# Altium project LED.PrjPcb
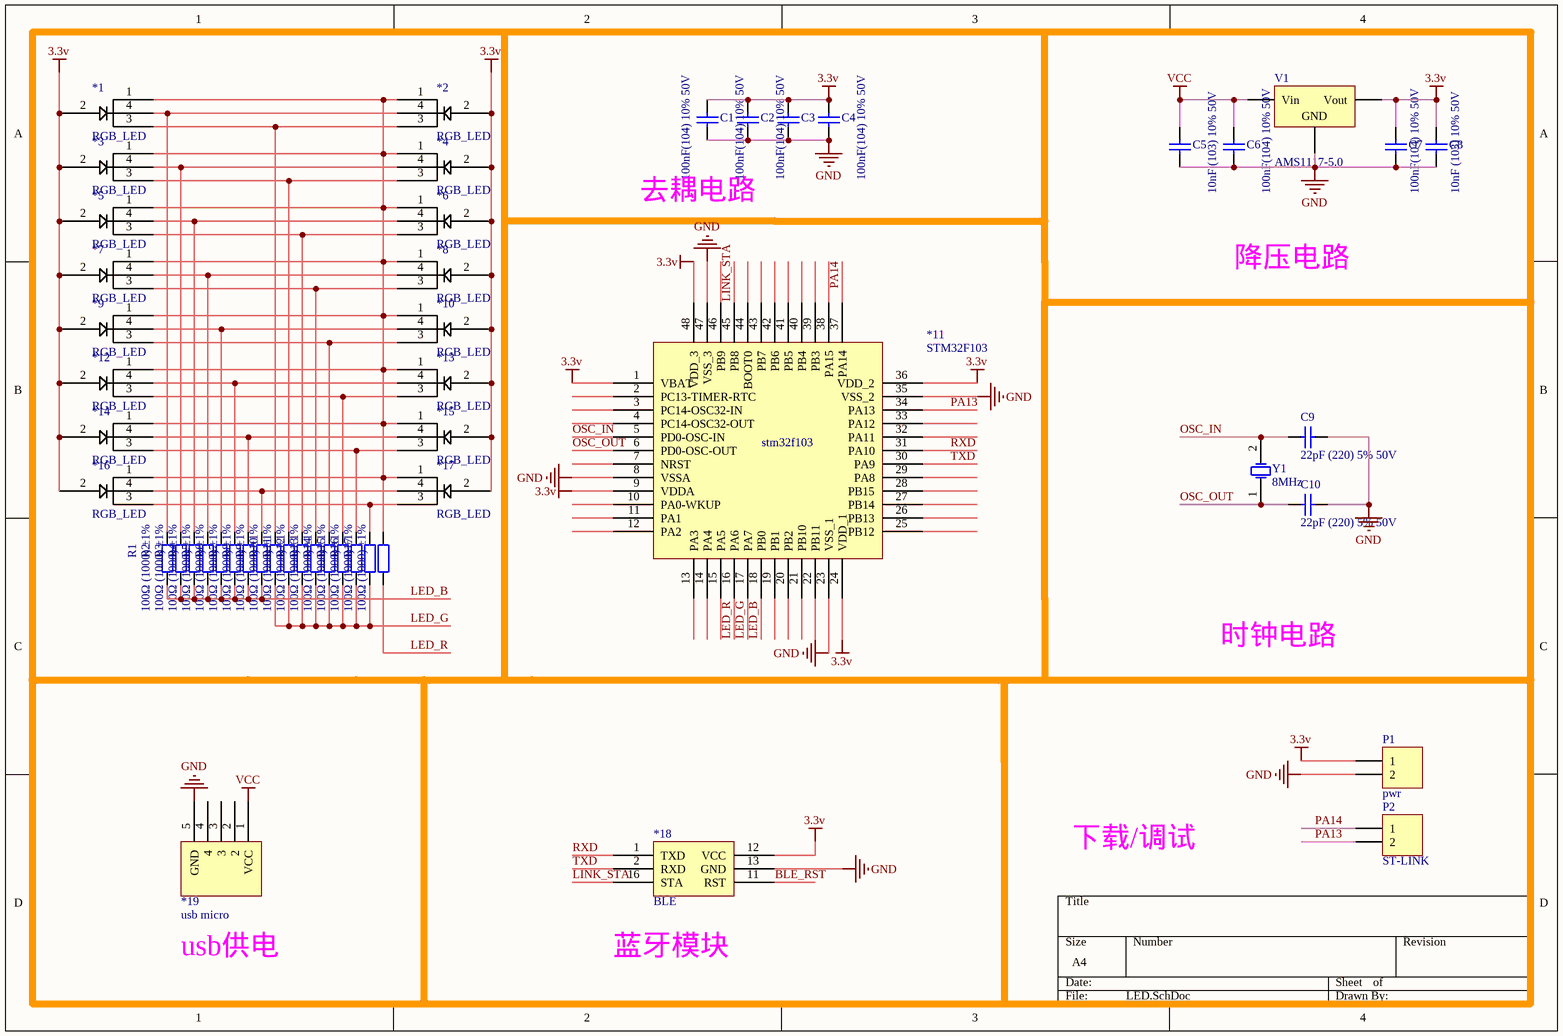
[diagram p0: LED.SchDoc]
1 sheet, 50 parts. Net scope: global (net labels, ports and power ports of the same name join across sheets).
Board file: LED.PcbDoc

## Sheet LED.SchDoc
size A4

### Parts
*1  RGB_LED  [LED_RGB]
*2  RGB_LED  [LED_RGB]
*3  RGB_LED  [LED_RGB]
*4  RGB_LED  [LED_RGB]
*5  RGB_LED  [LED_RGB]
*6  RGB_LED  [LED_RGB]
*7  RGB_LED  [LED_RGB]
*8  RGB_LED  [LED_RGB]
*9  RGB_LED  [LED_RGB]
*10  RGB_LED  [LED_RGB]
*11  STM32F103  [STM32 C8T6]
*12  RGB_LED  [LED_RGB]
*13  RGB_LED  [LED_RGB]
*14  RGB_LED  [LED_RGB]
*15  RGB_LED  [LED_RGB]
*16  RGB_LED  [LED_RGB]
*17  RGB_LED  [LED_RGB]
*18  BLE  [BLE]
*19  usb micro  [MICRO_USB]
C1  100nF(104) 10% 50V  [0805_C]
C2  100nF(104) 10% 50V  [0805_C]
C3  100nF(104) 10% 50V  [0805_C]
C4  100nF(104) 10% 50V  [0805_C]
C5  10nF (103) 10% 50V  [0805_C]
C6  100nF(104) 10% 50V  [0805_C]
C7  100nF(104) 10% 50V  [0805_C]
C8  10nF (103) 10% 50V  [0805_C]
C9  22pF (220) 5% 50V  [0805_C]
C10  22pF (220) 5% 50V  [0805_C]
P1  pwr  [HDR1X2]
P2  ST-LINK  [HDR1X2]
R1  100Ω (1000) ±1%  [0805_R]
R2  100Ω (1000) ±1%  [0805_R]
R3  100Ω (1000) ±1%  [0805_R]
R4  100Ω (1000) ±1%  [0805_R]
R5  100Ω (1000) ±1%  [0805_R]
R6  100Ω (1000) ±1%  [0805_R]
R7  100Ω (1000) ±1%  [0805_R]
R8  100Ω (1000) ±1%  [0805_R]
R9  100Ω (1000) ±1%  [0805_R]
R10  100Ω (1000) ±1%  [0805_R]
R11  100Ω (1000) ±1%  [0805_R]
R12  100Ω (1000) ±1%  [0805_R]
R13  100Ω (1000) ±1%  [0805_R]
R14  100Ω (1000) ±1%  [0805_R]
R15  100Ω (1000) ±1%  [0805_R]
R16  100Ω (1000) ±1%  [0805_R]
R17  100Ω (1000) ±1%  [0805_R]
V1  AMS1117-5.0  [SOT-223]
Y1  8MHz  [XTAL_US]

### Nets
3.3v: *1.2 *2.2 *3.2 *4.2 *5.2 *6.2 *7.2 *8.2 *9.2 *10.2 *11.1(VBAT) *11.9(VDDA) *11.24(VDD_1) *11.36(VDD_2) *11.48(VDD_3) *12.2 *13.2 *14.2 *15.2 *16.2 *17.2 *18.12(VCC) C1.2 C2.2 C3.2 C4.2 C7.2 C8.2 P1.1 V1.2(Vout)
GND: *11.8(VSSA) *11.23(VSS_1) *11.35(VSS_2) *11.47(VSS_3) *18.13(GND) *19.5(GND) C1.1 C2.1 C3.1 C4.1 C5.1 C6.1 C7.1 C8.1 C9.2 C10.2 P1.2 V1.1(GND)
VCC: *19.1(VCC) C5.2 C6.2 V1.3(Vin)
BLE_RST: *18.11(RST)
LED_B: *11.18(PB0) R1.2 R2.2 R3.2 R4.2 R5.2 R6.2 R7.2 R8.2
LED_G: *11.17(PA7) R9.2 R10.2 R11.2 R12.2 R13.2 R14.2 R15.2 R16.2
LED_R: *11.16(PA6) R17.2
LINK_STA: *11.45(PB8) *18.16(STA)
OSC_IN: *11.5(PD0-OSC-IN) C9.1 Y1.2(OSC2)
OSC_OUT: *11.6(PD0-OSC-OUT) C10.1 Y1.1(OSC1)
PA13: *11.34(PA13) P2.2
PA14: *11.37(PA14) P2.1
RXD: *11.31(PA10) *18.1(TXD)
TXD: *11.30(PA9) *18.2(RXD)
Net*1_1: *1.1 *2.1 *3.1 *4.1 *5.1 *6.1 *7.1 *8.1 *9.1 *10.1 *12.1 *13.1 *14.1 *15.1 *16.1 *17.1 R17.1
Net*1_3: *1.3 *2.3 R9.1
Net*1_4: *1.4 *2.4 R1.1
Net*3_3: *3.3 *4.3 R10.1
Net*3_4: *3.4 *4.4 R2.1
Net*5_3: *5.3 *6.3 R11.1
Net*5_4: *5.4 *6.4 R3.1
Net*7_3: *7.3 *8.3 R12.1
Net*7_4: *7.4 *8.4 R4.1
Net*9_3: *9.3 *10.3 R13.1
Net*9_4: *9.4 *10.4 R5.1
Net*12_3: *12.3 *13.3 R14.1
Net*12_4: *12.4 *13.4 R6.1
Net*14_3: *14.3 *15.3 R15.1
Net*14_4: *14.4 *15.4 R7.1
Net*16_3: *16.3 *17.3 R16.1
Net*16_4: *16.4 *17.4 R8.1

Not connected (* = marked no-connect by the designer): *11 2(PC13-TIMER-RTC) 3(PC14-OSC32-IN) 4(PC14-OSC32-OUT) 7(NRST) 10(PA0-WKUP) 11(PA1) 12(PA2) 13(PA3) 14(PA4) 15(PA5) 19(PB1) 20(PB2) 21(PB10) 22(PB11) 25(PB12) 26(PB13) 27(PB14) 28(PB15) 29(PA8) 32(PA11) 33(PA12) 38(PA15) 39(PB3) 40(PB4) 41(PB5) 42(PB6) 43(PB7) 44(BOOT0) 46(PB9); *19 2 3 4

### Notes on the sheet
- 去耦电路
- 降压电路
- 时钟电路
- 下载/调试
- usb供电
- (near *18) 蓝牙模块
- (in symbol STM32F103) stm32f103

### Library data of the parts
C1-C4 C6 C7 = 0805 100nF(104) 10% 50V: 贴片电容; ComponentLink1Description: 供应商链接; ComponentLink1URL: http://www.szlcsc.com/product/details_50686.html; Package: 0805; Supplier: LC; SuppliersPartNumber: C49678
C5 C8 = 0805 10nF (103) 10% 50V: 贴片电容; ComponentLink1Description: 供应商链接; ComponentLink1URL: http://www.szlcsc.com/product/details_2062.html; Package: 0805; Supplier: LC; SuppliersPartNumber: C1710
C9 C10 = 0805 22pF (220) 5% 50V: 贴片电容; ComponentLink1Description: 供应商链接; ComponentLink1URL: http://www.szlcsc.com/product/details_2156.html; Package: 0805; Supplier: LC; SuppliersPartNumber: C1804
P1 P2 = Header 2: Header, 2-Pin; LatestRevisionDate: 17-Jul-2002; LatestRevisionNote: Re-released for DXP Platform.; Publisher: Altium Limited
R1-R17 = 0805 100Ω (1000) 1%: 贴片电阻; ComponentLink1Description: 供应商链接; ComponentLink1URL: http://www.szlcsc.com/product/details_18096.html; Package: 0805; Supplier: LC; SuppliersPartNumber: C17408
V1 = SOT-223 AMS1117-5.0: 低压差线性稳压(LDO); ComponentLink1Description: 供应商链接; ComponentLink1URL: http://www.szlcsc.com/product/details_6653.html; Package: SOT-223; Supplier: LC; SuppliersPartNumber: C6187
Y1 = XTAL: Crystal Oscillator; Published: 8-Jun-2000; LatestRevisionDate: 17-Jul-2002; LatestRevisionNote: Re-released for DXP Platform.; Publisher: Altium Limited